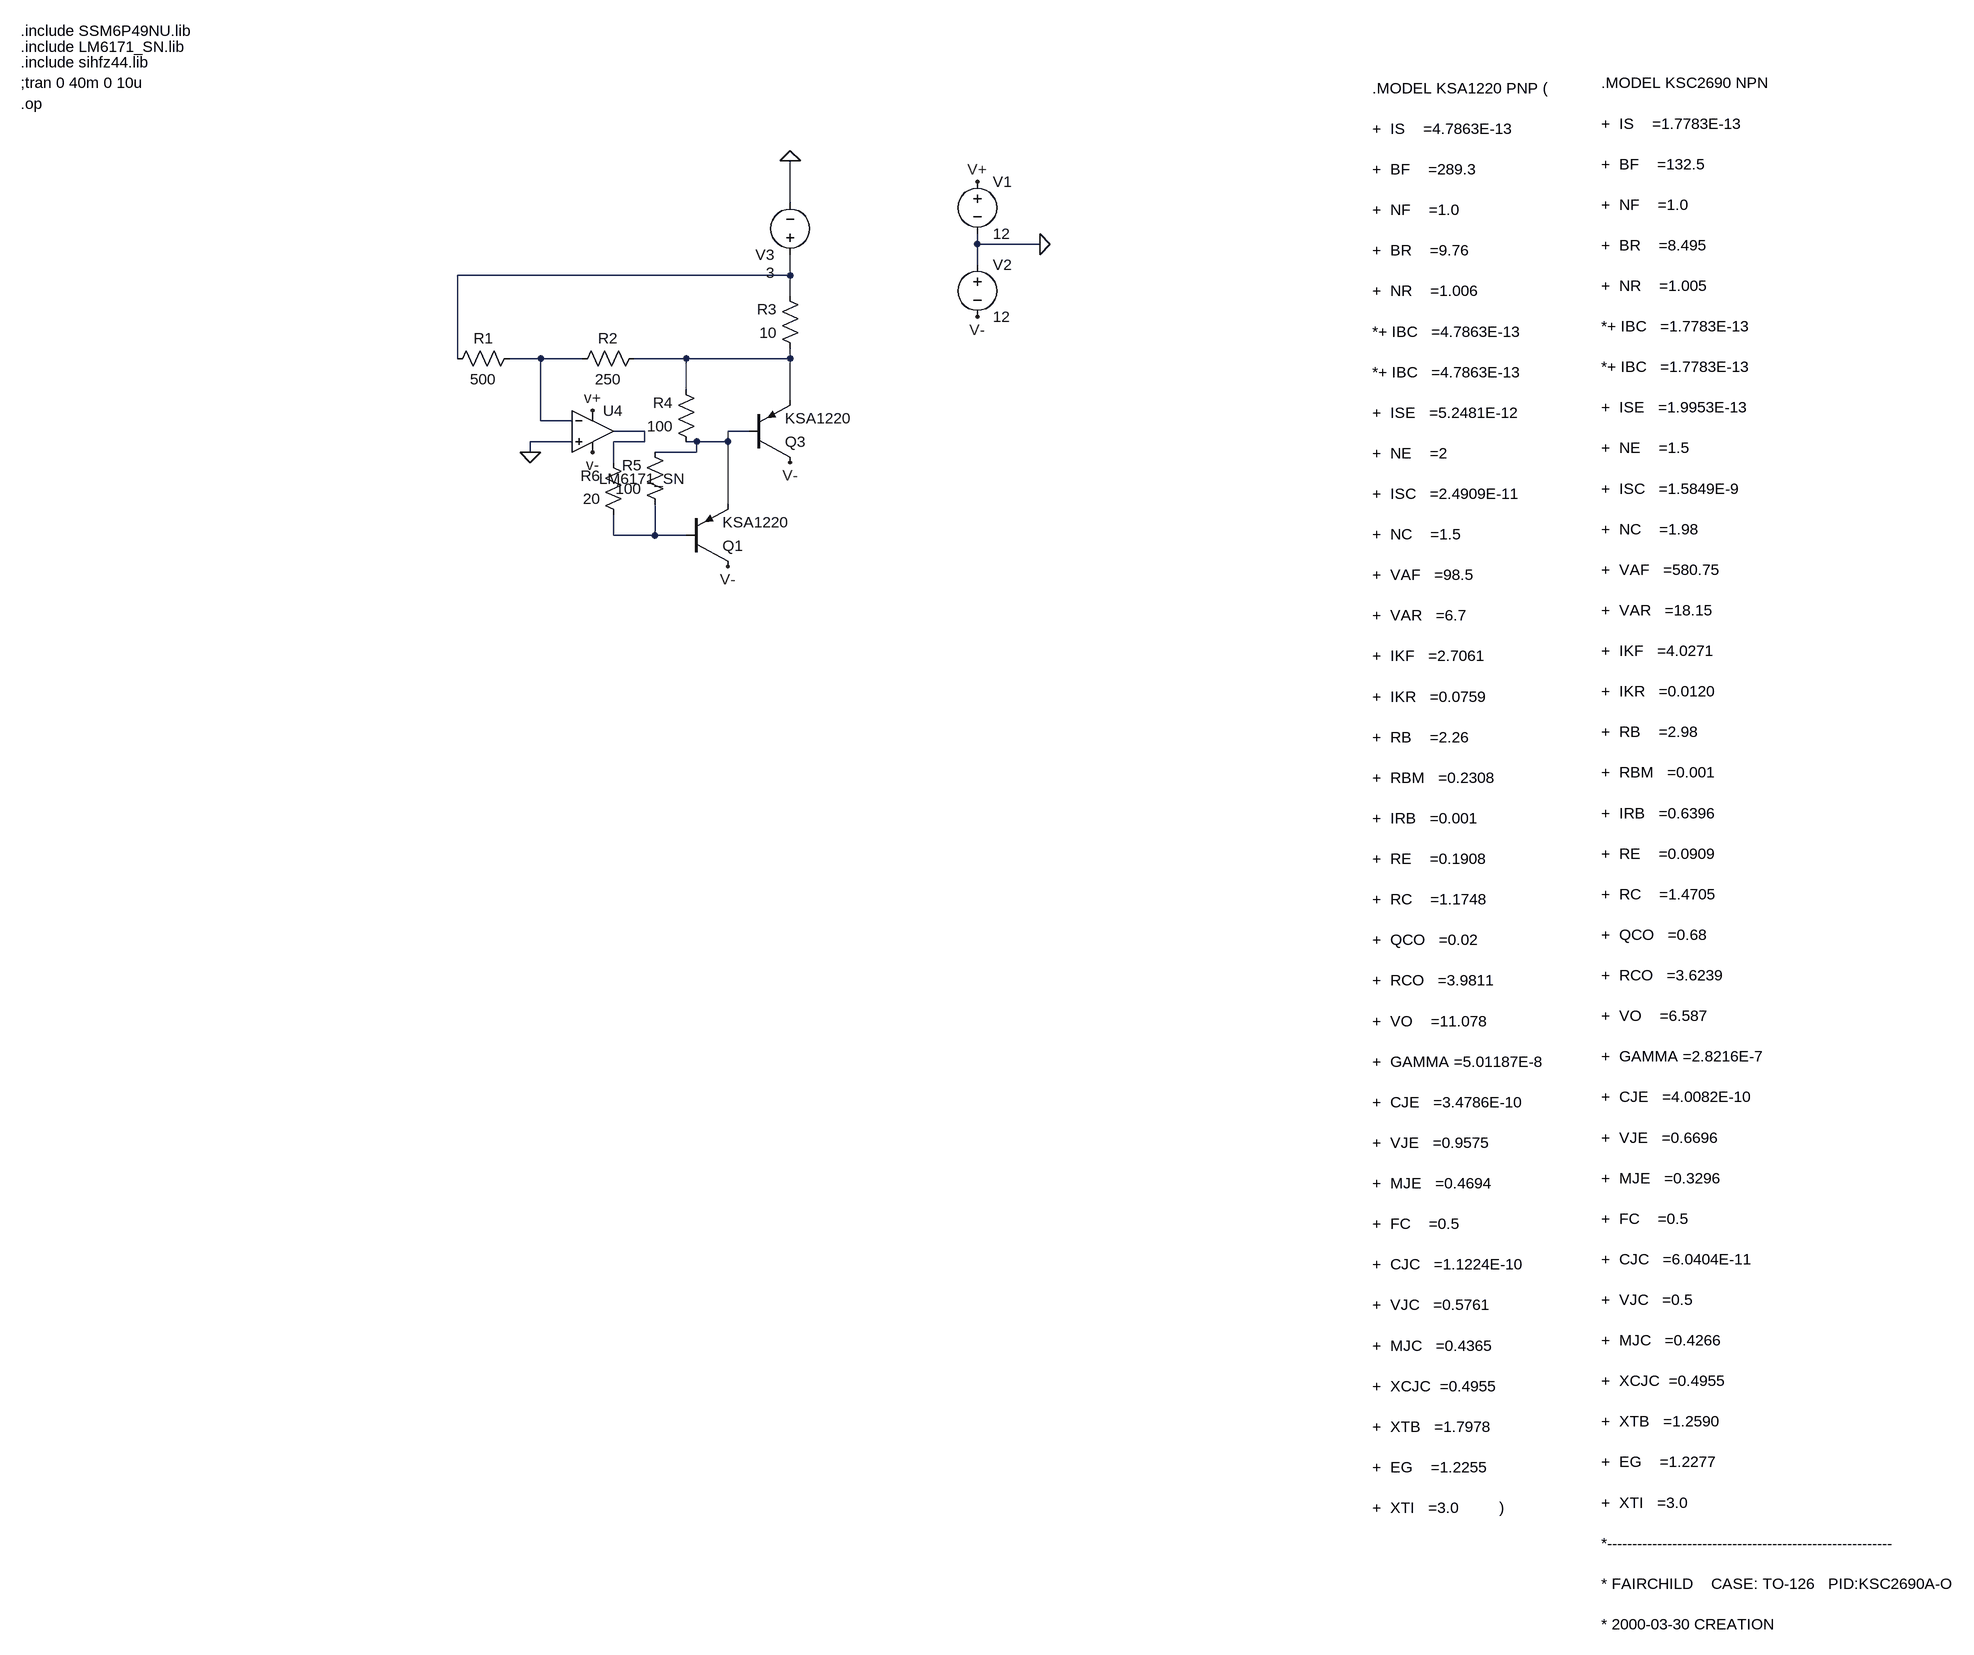
[diagram p0: schematic DC-DC_res.asc]
DC-DC_res.asc, the LTspice schematic file:
Version 4
SHEET 1 2640 680
WIRE 768 -224 768 -288
WIRE 1056 -160 1056 -176
WIRE 1152 -160 1056 -160
WIRE 1056 -128 1056 -160
WIRE 768 -112 768 -144
WIRE 768 -112 256 -112
WIRE 768 -80 768 -112
WIRE 256 16 256 -112
WIRE 384 16 336 16
WIRE 448 16 384 16
WIRE 608 16 528 16
WIRE 768 16 768 0
WIRE 768 16 608 16
WIRE 608 64 608 16
WIRE 768 80 768 16
WIRE 384 112 384 16
WIRE 432 112 384 112
WIRE 544 128 496 128
WIRE 704 128 672 128
WIRE 432 144 368 144
WIRE 544 144 544 128
WIRE 544 144 496 144
WIRE 624 144 608 144
WIRE 672 144 672 128
WIRE 672 144 624 144
WIRE 368 160 368 144
WIRE 624 160 624 144
WIRE 624 160 560 160
WIRE 496 176 496 144
WIRE 672 240 672 144
WIRE 496 288 496 256
WIRE 560 288 560 240
WIRE 560 288 496 288
WIRE 608 288 560 288
FLAG 464 96 v+
FLAG 464 160 v-
FLAG 1152 -160 0
FLAG 1056 -256 V+
FLAG 1056 -48 V-
FLAG 368 160 0
FLAG 768 -288 0
FLAG 768 176 V-
FLAG 672 336 V-
SYMBOL Opamps\\opamp2 464 64 R0
WINDOW 3 10 137 Left 2
SYMATTR Value LM6171_SN
SYMATTR InstName U4
SYMBOL voltage 1056 -272 R0
WINDOW 123 0 0 Left 2
WINDOW 39 0 0 Left 2
SYMATTR InstName V1
SYMATTR Value 12
SYMBOL voltage 1056 -144 R0
WINDOW 123 0 0 Left 2
WINDOW 39 0 0 Left 2
SYMATTR InstName V2
SYMATTR Value 12
SYMBOL pnp 704 176 M180
SYMATTR InstName Q3
SYMATTR Value KSA1220
SYMBOL voltage 768 -128 R180
WINDOW 123 0 0 Left 2
WINDOW 39 -118 -3 Left 2
WINDOW 3 24 -12 Left 2
SYMATTR InstName V3
SYMATTR Value 3
SYMBOL res 352 0 R90
WINDOW 0 0 56 VBottom 2
WINDOW 3 32 56 VTop 2
SYMATTR InstName R1
SYMATTR Value 500
SYMBOL res 544 0 R90
WINDOW 0 0 56 VBottom 2
WINDOW 3 32 56 VTop 2
SYMATTR InstName R2
SYMATTR Value 250
SYMBOL res 784 16 R180
WINDOW 0 36 76 Left 2
WINDOW 3 36 40 Left 2
SYMATTR InstName R3
SYMATTR Value 10
SYMBOL pnp 608 336 M180
SYMATTR InstName Q1
SYMATTR Value KSA1220
SYMBOL res 624 160 R180
WINDOW 0 36 76 Left 2
WINDOW 3 36 40 Left 2
SYMATTR InstName R4
SYMATTR Value 100
SYMBOL res 576 256 R180
WINDOW 0 36 76 Left 2
WINDOW 3 36 40 Left 2
SYMATTR InstName R5
SYMATTR Value 100
SYMBOL res 512 272 R180
WINDOW 0 36 76 Left 2
WINDOW 3 36 40 Left 2
SYMATTR InstName R6
SYMATTR Value 20
TEXT -416 -376 Left 2 !.op
TEXT -416 -464 Left 2 !.include LM6171_SN.lib
TEXT -416 -408 Left 2 !;tran 0 40m 0 10u
TEXT -416 -440 Left 2 !.include sihfz44.lib
TEXT -416 -488 Left 2 !.include SSM6P49NU.lib
TEXT 1664 -400 Left 2 !.MODEL KSA1220 PNP ( \n\n+  IS    =4.7863E-13      \n\n+  BF    =289.3\n\n+  NF    =1.0 \n\n+  BR    =9.76\n\n+  NR    =1.006\n\n*+ IBC   =4.7863E-13\n\n*+ IBC   =4.7863E-13\n\n+  ISE   =5.2481E-12\n\n+  NE    =2\n\n+  ISC   =2.4909E-11\n\n+  NC    =1.5\n\n+  VAF   =98.5\n\n+  VAR   =6.7\n\n+  IKF   =2.7061\n\n+  IKR   =0.0759\n\n+  RB    =2.26\n\n+  RBM   =0.2308\n\n+  IRB   =0.001\n\n+  RE    =0.1908\n\n+  RC    =1.1748\n\n+  QCO   =0.02\n\n+  RCO   =3.9811\n\n+  VO    =11.078\n\n+  GAMMA =5.01187E-8\n\n+  CJE   =3.4786E-10\n\n+  VJE   =0.9575\n\n+  MJE   =0.4694\n\n+  FC    =0.5\n\n+  CJC   =1.1224E-10\n\n+  VJC   =0.5761\n\n+  MJC   =0.4365\n\n+  XCJC  =0.4955   \n\n+  XTB   =1.7978    \n\n+  EG    =1.2255 \n\n+  XTI   =3.0         )
TEXT 2016 -408 Left 2 !.MODEL KSC2690 NPN\n\n+  IS    =1.7783E-13      \n\n+  BF    =132.5\n\n+  NF    =1.0 \n\n+  BR    =8.495\n\n+  NR    =1.005\n\n*+ IBC   =1.7783E-13 \n\n*+ IBC   =1.7783E-13 \n\n+  ISE   =1.9953E-13\n\n+  NE    =1.5\n\n+  ISC   =1.5849E-9\n\n+  NC    =1.98\n\n+  VAF   =580.75\n\n+  VAR   =18.15\n\n+  IKF   =4.0271\n\n+  IKR   =0.0120\n\n+  RB    =2.98\n\n+  RBM   =0.001\n\n+  IRB   =0.6396\n\n+  RE    =0.0909\n\n+  RC    =1.4705\n\n+  QCO   =0.68\n\n+  RCO   =3.6239\n\n+  VO    =6.587\n\n+  GAMMA =2.8216E-7\n\n+  CJE   =4.0082E-10\n\n+  VJE   =0.6696\n\n+  MJE   =0.3296\n\n+  FC    =0.5\n\n+  CJC   =6.0404E-11\n\n+  VJC   =0.5\n\n+  MJC   =0.4266\n\n+  XCJC  =0.4955   \n\n+  XTB   =1.2590    \n\n+  EG    =1.2277 \n\n+  XTI   =3.0         \n\n*---------------------------------------------------------\n\n* FAIRCHILD    CASE: TO-126   PID:KSC2690A-O\n\n* 2000-03-30 CREATION

The netlist it stands for:
* DC-DC_res.asc
XU4 0 N002 v+ v- N004 LM6171_SN  ; pins In+ In- V+ V- OUT
V1 v+ 0 12
V2 0 v- 12
Q3 v- N005 N003 0 KSA1220
V3 N001 0 3
R1 N002 N001 500
R2 N003 N002 250
R3 N003 N001 10
Q1 v- N006 N005 0 KSA1220
R4 N005 N003 100
R5 N006 N005 100
R6 N006 N004 20
.model NPN NPN
.model PNP PNP
.lib standard.bjt
.op
.include LM6171_SN.lib
;tran 0 40m 0 10u
.include sihfz44.lib
.include SSM6P49NU.lib
.MODEL KSA1220 PNP (
+  IS    =4.7863E-13
+  BF    =289.3
+  NF    =1.0
+  BR    =9.76
+  NR    =1.006
*+ IBC   =4.7863E-13
*+ IBC   =4.7863E-13
+  ISE   =5.2481E-12
+  NE    =2
+  ISC   =2.4909E-11
+  NC    =1.5
+  VAF   =98.5
+  VAR   =6.7
+  IKF   =2.7061
+  IKR   =0.0759
+  RB    =2.26
+  RBM   =0.2308
+  IRB   =0.001
+  RE    =0.1908
+  RC    =1.1748
+  QCO   =0.02
+  RCO   =3.9811
+  VO    =11.078
+  GAMMA =5.01187E-8
+  CJE   =3.4786E-10
+  VJE   =0.9575
+  MJE   =0.4694
+  FC    =0.5
+  CJC   =1.1224E-10
+  VJC   =0.5761
+  MJC   =0.4365
+  XCJC  =0.4955
+  XTB   =1.7978
+  EG    =1.2255
+  XTI   =3.0         )
.MODEL KSC2690 NPN
+  IS    =1.7783E-13
+  BF    =132.5
+  NF    =1.0
+  BR    =8.495
+  NR    =1.005
*+ IBC   =1.7783E-13
*+ IBC   =1.7783E-13
+  ISE   =1.9953E-13
+  NE    =1.5
+  ISC   =1.5849E-9
+  NC    =1.98
+  VAF   =580.75
+  VAR   =18.15
+  IKF   =4.0271
+  IKR   =0.0120
+  RB    =2.98
+  RBM   =0.001
+  IRB   =0.6396
+  RE    =0.0909
+  RC    =1.4705
+  QCO   =0.68
+  RCO   =3.6239
+  VO    =6.587
+  GAMMA =2.8216E-7
+  CJE   =4.0082E-10
+  VJE   =0.6696
+  MJE   =0.3296
+  FC    =0.5
+  CJC   =6.0404E-11
+  VJC   =0.5
+  MJC   =0.4266
+  XCJC  =0.4955
+  XTB   =1.2590
+  EG    =1.2277
+  XTI   =3.0
*---------------------------------------------------------
* FAIRCHILD    CASE: TO-126   PID:KSC2690A-O
* 2000-03-30 CREATION
.backanno
.end